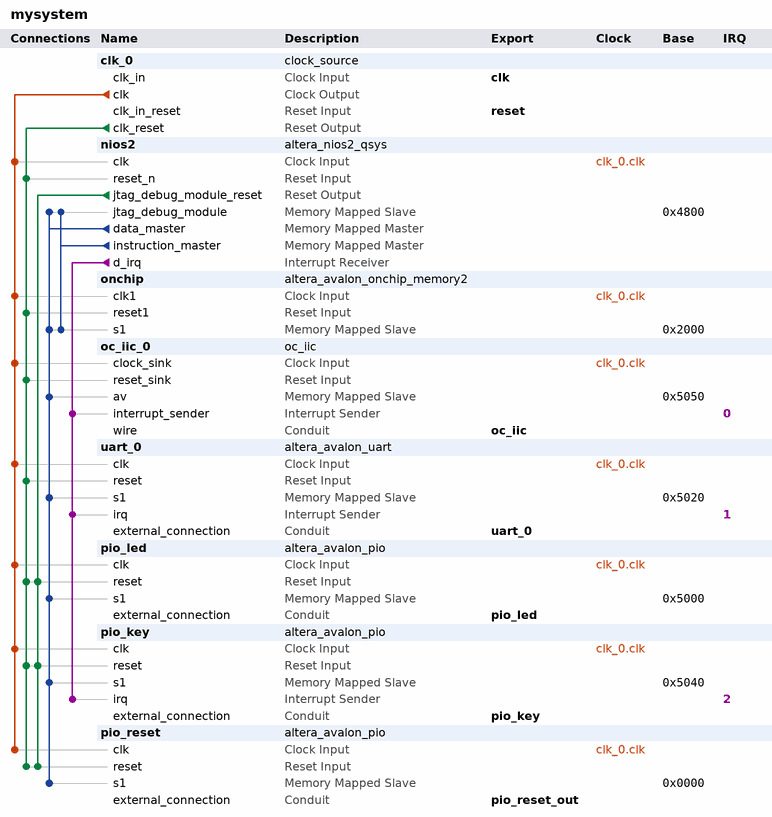
[diagram p0: system contents]
# Platform Designer (Qsys) system mysystem, Cyclone IV E EP4CE10F17C8
# Parameters at their usual value, and those the tool derives, are not listed.
package require -exact qsys 13.0.1
create_system mysystem
set_project_property DEVICE_FAMILY {Cyclone IV E}
set_project_property DEVICE EP4CE10F17C8

add_instance clk_0 clock_source 13.0
set_instance_parameter_value clk_0 clockFrequency 50000000

add_instance nios2 altera_nios2_qsys 13.0
set_instance_parameter_value nios2 resetSlave onchip.s1
set_instance_parameter_value nios2 mmu_TLBMissExcSlave None
set_instance_parameter_value nios2 exceptionSlave onchip.s1
set_instance_parameter_value nios2 breakSlave nios2.jtag_debug_module
set_instance_parameter_value nios2 impl Tiny
set_instance_parameter_value nios2 icache_size 4096

add_instance onchip altera_avalon_onchip_memory2 13.0.1
set_instance_parameter_value onchip dataWidth 32
set_instance_parameter_value onchip dualPort false
set_instance_parameter_value onchip initMemContent true
set_instance_parameter_value onchip initializationFileName onchip_mem.hex
set_instance_parameter_value onchip memorySize 8192

add_instance oc_iic_0 oc_iic 1.0

add_instance uart_0 altera_avalon_uart 13.0.1
set_instance_parameter_value uart_0 baud 115200
set_instance_parameter_value uart_0 dataBits 8
set_instance_parameter_value uart_0 fixedBaud false
set_instance_parameter_value uart_0 parity NONE
set_instance_parameter_value uart_0 stopBits 1

add_instance pio_led altera_avalon_pio 13.0.1
set_instance_parameter_value pio_led bitModifyingOutReg true
set_instance_parameter_value pio_led captureEdge true
set_instance_parameter_value pio_led direction Output
set_instance_parameter_value pio_led edgeType FALLING
set_instance_parameter_value pio_led generateIRQ true
set_instance_parameter_value pio_led irqType EDGE
set_instance_parameter_value pio_led resetValue 15
set_instance_parameter_value pio_led width 4

add_instance pio_key altera_avalon_pio 13.0.1
set_instance_parameter_value pio_key captureEdge true
set_instance_parameter_value pio_key direction Input
set_instance_parameter_value pio_key edgeType FALLING
set_instance_parameter_value pio_key generateIRQ true
set_instance_parameter_value pio_key irqType EDGE
set_instance_parameter_value pio_key width 2

add_instance pio_reset altera_avalon_pio 13.0.1
set_instance_parameter_value pio_reset direction Output
set_instance_parameter_value pio_reset resetValue 1
set_instance_parameter_value pio_reset width 1

# connections
add_connection clk_0.clk nios2.clk clock
add_connection clk_0.clk oc_iic_0.clock_sink clock
add_connection clk_0.clk onchip.clk1 clock
add_connection clk_0.clk pio_key.clk clock
add_connection clk_0.clk pio_led.clk clock
add_connection clk_0.clk pio_reset.clk clock
add_connection clk_0.clk uart_0.clk clock
add_connection clk_0.clk_reset nios2.reset_n reset
add_connection clk_0.clk_reset oc_iic_0.reset_sink reset
add_connection clk_0.clk_reset onchip.reset1 reset
add_connection clk_0.clk_reset pio_key.reset reset
add_connection clk_0.clk_reset pio_led.reset reset
add_connection clk_0.clk_reset pio_reset.reset reset
add_connection clk_0.clk_reset uart_0.reset reset
add_connection nios2.jtag_debug_module_reset pio_key.reset reset
add_connection nios2.jtag_debug_module_reset pio_led.reset reset
add_connection nios2.jtag_debug_module_reset pio_reset.reset reset
add_connection nios2.data_master nios2.jtag_debug_module avalon
set_connection_parameter_value nios2.data_master/nios2.jtag_debug_module baseAddress 0x4800
add_connection nios2.data_master oc_iic_0.av avalon
set_connection_parameter_value nios2.data_master/oc_iic_0.av baseAddress 0x5050
add_connection nios2.data_master onchip.s1 avalon
set_connection_parameter_value nios2.data_master/onchip.s1 baseAddress 0x2000
add_connection nios2.data_master pio_key.s1 avalon
set_connection_parameter_value nios2.data_master/pio_key.s1 baseAddress 0x5040
add_connection nios2.data_master pio_led.s1 avalon
set_connection_parameter_value nios2.data_master/pio_led.s1 baseAddress 0x5000
add_connection nios2.data_master pio_reset.s1 avalon
set_connection_parameter_value nios2.data_master/pio_reset.s1 baseAddress 0x0000
add_connection nios2.data_master uart_0.s1 avalon
set_connection_parameter_value nios2.data_master/uart_0.s1 baseAddress 0x5020
add_connection nios2.instruction_master nios2.jtag_debug_module avalon
set_connection_parameter_value nios2.instruction_master/nios2.jtag_debug_module baseAddress 0x4800
add_connection nios2.instruction_master onchip.s1 avalon
set_connection_parameter_value nios2.instruction_master/onchip.s1 baseAddress 0x2000
add_connection nios2.d_irq oc_iic_0.interrupt_sender interrupt
set_connection_parameter_value nios2.d_irq/oc_iic_0.interrupt_sender irqNumber 0
add_connection nios2.d_irq pio_key.irq interrupt
set_connection_parameter_value nios2.d_irq/pio_key.irq irqNumber 2
add_connection nios2.d_irq uart_0.irq interrupt
set_connection_parameter_value nios2.d_irq/uart_0.irq irqNumber 1

# exported interfaces
add_interface clk clock sink
set_interface_property clk EXPORT_OF clk_0.clk_in
add_interface reset reset sink
set_interface_property reset EXPORT_OF clk_0.clk_in_reset
add_interface oc_iic conduit end
set_interface_property oc_iic EXPORT_OF oc_iic_0.wire
add_interface uart_0 conduit end
set_interface_property uart_0 EXPORT_OF uart_0.external_connection
add_interface pio_key conduit end
set_interface_property pio_key EXPORT_OF pio_key.external_connection
add_interface pio_led conduit end
set_interface_property pio_led EXPORT_OF pio_led.external_connection
add_interface pio_reset_out conduit end
set_interface_property pio_reset_out EXPORT_OF pio_reset.external_connection

set_interconnect_requirement {$system} qsys_mm.clockCrossingAdapter HANDSHAKE
set_interconnect_requirement {$system} qsys_mm.maxAdditionalLatency 1

save_system mysystem.qsys
